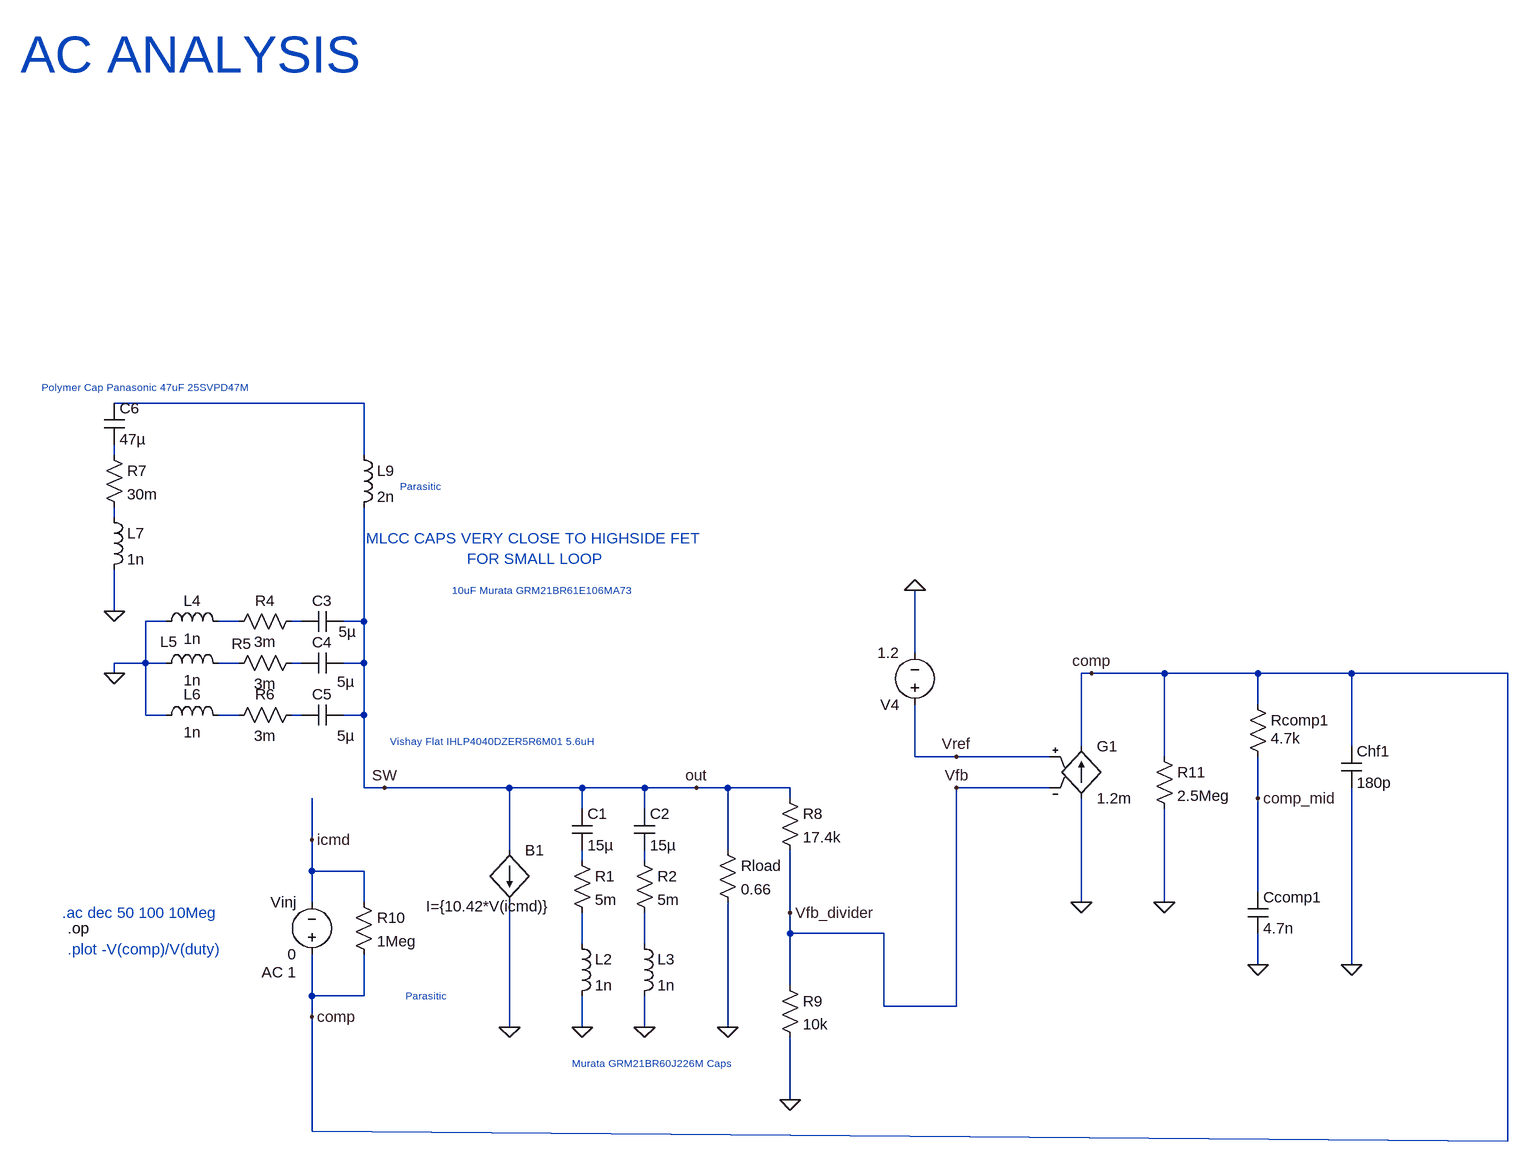
[diagram p0: schematic AC analysis.asc]
AC analysis.asc, the LTspice schematic file:
Version 4.1
SHEET 1 2836 904
WIRE 1072 -400 688 -400
WIRE 688 -320 688 -336
WIRE 1072 -320 1072 -400
WIRE 688 -224 688 -240
WIRE 688 -80 688 -144
WIRE 768 -64 736 -64
WIRE 880 -64 848 -64
WIRE 976 -64 960 -64
WIRE 1072 -64 1072 -240
WIRE 1072 -64 1040 -64
WIRE 1920 -16 1920 -112
WIRE 736 0 736 -64
WIRE 736 0 688 0
WIRE 768 0 736 0
WIRE 880 0 848 0
WIRE 976 0 960 0
WIRE 1072 0 1072 -64
WIRE 1072 0 1040 0
WIRE 688 16 688 0
WIRE 2192 16 2176 16
WIRE 2304 16 2192 16
WIRE 2448 16 2304 16
WIRE 2592 16 2448 16
WIRE 2832 16 2592 16
WIRE 2448 64 2448 16
WIRE 736 80 736 0
WIRE 768 80 736 80
WIRE 880 80 848 80
WIRE 976 80 960 80
WIRE 1072 80 1072 0
WIRE 1072 80 1040 80
WIRE 2176 128 2176 16
WIRE 2592 128 2592 16
WIRE 1920 144 1920 64
WIRE 1984 144 1920 144
WIRE 2128 144 1984 144
WIRE 2304 144 2304 16
WIRE 1072 192 1072 80
WIRE 1104 192 1072 192
WIRE 1296 192 1104 192
WIRE 1408 192 1296 192
WIRE 1504 192 1408 192
WIRE 1584 192 1504 192
WIRE 1632 192 1584 192
WIRE 1728 192 1632 192
WIRE 2128 192 1984 192
WIRE 1728 208 1728 192
WIRE 2448 208 2448 144
WIRE 1408 224 1408 192
WIRE 1504 224 1504 192
WIRE 992 272 992 208
WIRE 1296 288 1296 192
WIRE 1632 288 1632 192
WIRE 1408 304 1408 288
WIRE 1504 304 1504 288
WIRE 992 320 992 272
WIRE 1072 320 992 320
WIRE 2448 352 2448 208
WIRE 992 368 992 320
WIRE 1072 368 1072 320
WIRE 2176 368 2176 208
WIRE 2304 368 2304 224
WIRE 1728 384 1728 288
WIRE 1728 416 1728 384
WIRE 1872 416 1728 416
WIRE 1408 432 1408 384
WIRE 1504 432 1504 384
WIRE 2448 464 2448 416
WIRE 2592 464 2592 192
WIRE 1728 496 1728 416
WIRE 992 512 992 448
WIRE 1072 512 1072 448
WIRE 1072 512 992 512
WIRE 1872 528 1872 416
WIRE 1984 528 1984 192
WIRE 1984 528 1872 528
WIRE 992 544 992 512
WIRE 1296 560 1296 368
WIRE 1408 560 1408 512
WIRE 1504 560 1504 512
WIRE 1632 560 1632 368
WIRE 1728 672 1728 576
WIRE 992 720 992 544
WIRE 2832 736 2832 16
WIRE 2832 736 992 720
FLAG 1408 560 0
FLAG 1504 560 0
FLAG 688 16 0
FLAG 688 -80 0
FLAG 1104 192 SW
FLAG 1984 144 Vref
FLAG 1984 192 Vfb
FLAG 2192 16 comp
FLAG 2176 368 0
FLAG 1920 -112 0
FLAG 1728 672 0
FLAG 2448 464 0
FLAG 2592 464 0
FLAG 2448 208 comp_mid
FLAG 1584 192 out
FLAG 1728 384 Vfb_divider
FLAG 992 272 icmd
FLAG 992 544 comp
FLAG 2304 368 0
FLAG 1296 560 0
FLAG 1632 560 0
DATAFLAG 2064 192 ""
DATAFLAG 2064 144 ""
DATAFLAG 2384 16 ""
DATAFLAG 1776 416 ""
DATAFLAG 1664 192 ""
SYMBOL cap 1392 224 R0
SYMATTR InstName C1
SYMATTR Value 15µ
SYMBOL cap 1488 224 R0
SYMATTR InstName C2
SYMATTR Value 15µ
SYMBOL res 1392 288 R0
SYMATTR InstName R1
SYMATTR Value 5m
SYMBOL ind 1392 416 R0
SYMATTR InstName L2
SYMATTR Value 1n
SYMATTR SpiceLine Rser=0
SYMBOL ind 1488 416 R0
SYMATTR InstName L3
SYMATTR Value 1n
SYMATTR SpiceLine Rser=0
SYMBOL res 1488 288 R0
SYMATTR InstName R2
SYMATTR Value 5m
SYMBOL cap 1040 -80 R90
WINDOW 0 0 32 VBottom 2
WINDOW 3 16 -7 VTop 2
SYMATTR InstName C3
SYMATTR Value 5µ
SYMBOL cap 1040 -16 R90
WINDOW 0 0 32 VBottom 2
WINDOW 3 29 -4 VTop 2
SYMATTR InstName C4
SYMATTR Value 5µ
SYMBOL cap 1040 64 R90
WINDOW 0 0 32 VBottom 2
WINDOW 3 32 -4 VTop 2
SYMATTR InstName C5
SYMATTR Value 5µ
SYMBOL res 976 -80 R90
WINDOW 0 0 56 VBottom 2
WINDOW 3 32 56 VTop 2
SYMATTR InstName R4
SYMATTR Value 3m
SYMBOL ind 752 -48 R270
WINDOW 0 32 56 VTop 2
WINDOW 3 5 56 VBottom 2
SYMATTR InstName L4
SYMATTR Value 1n
SYMATTR SpiceLine Rser=0
SYMBOL ind 752 16 R270
WINDOW 0 33 20 VTop 2
WINDOW 3 5 56 VBottom 2
SYMATTR InstName L5
SYMATTR Value 1n
SYMATTR SpiceLine Rser=0
SYMBOL ind 752 96 R270
WINDOW 0 32 56 VTop 2
WINDOW 3 5 56 VBottom 2
SYMATTR InstName L6
SYMATTR Value 1n
SYMATTR SpiceLine Rser=0
SYMBOL res 976 -16 R90
WINDOW 0 2 92 VBottom 2
WINDOW 3 32 56 VTop 2
SYMATTR InstName R5
SYMATTR Value 3m
SYMBOL res 976 64 R90
WINDOW 0 0 56 VBottom 2
WINDOW 3 32 56 VTop 2
SYMATTR InstName R6
SYMATTR Value 3m
SYMBOL cap 672 -400 R0
SYMATTR InstName C6
SYMATTR Value 47µ
SYMBOL res 672 -336 R0
SYMATTR InstName R7
SYMATTR Value 30m
SYMBOL ind 672 -240 R0
SYMATTR InstName L7
SYMATTR Value 1n
SYMATTR SpiceLine Rser=0
SYMBOL ind 1056 -336 R0
SYMATTR InstName L9
SYMATTR Value 2n
SYMATTR SpiceLine Rser=1m
SYMBOL g 2176 112 R0
SYMATTR InstName G1
SYMATTR Value 1.2m
SYMBOL voltage 1920 80 R180
WINDOW 123 0 0 Left 0
WINDOW 39 0 0 Left 0
SYMATTR InstName V4
SYMATTR Value 1.2
SYMBOL res 1712 192 R0
SYMATTR InstName R8
SYMATTR Value 17.4k
SYMBOL res 1712 480 R0
SYMATTR InstName R9
SYMATTR Value 10k
SYMBOL res 2432 48 R0
WINDOW 3 36 68 Left 2
SYMATTR Value 4.7k
SYMATTR InstName Rcomp1
SYMBOL cap 2576 128 R0
SYMATTR InstName Chf1
SYMATTR Value 180p
SYMBOL cap 2432 352 R0
SYMATTR InstName Ccomp1
SYMATTR Value 4.7n
SYMBOL voltage 992 464 R180
WINDOW 0 24 96 Left 2
WINDOW 3 24 16 Left 2
WINDOW 123 24 -12 Left 2
WINDOW 39 0 0 Left 0
SYMATTR InstName Vinj
SYMATTR Value 0
SYMATTR Value2 AC 1
SYMBOL res 1056 352 R0
SYMATTR InstName R10
SYMATTR Value 1Meg
SYMBOL res 2288 128 R0
SYMATTR InstName R11
SYMATTR Value 2.5Meg
SYMBOL bi 1296 288 R0
WINDOW 3 -128 86 Left 2
SYMATTR InstName B1
SYMATTR Value I={10.42*V(icmd)}
SYMBOL res 1616 272 R0
SYMATTR InstName Rload
SYMATTR Value 0.66
TEXT 1392 616 Left 1 ;Murata GRM21BR60J226M Caps
TEXT 1112 120 Left 1 ;Vishay Flat IHLP4040DZER5R6M01 5.6uH
TEXT 1336 -176 Center 2 ;MLCC CAPS VERY CLOSE TO HIGHSIDE FET \nFOR SMALL LOOP
TEXT 1208 -112 Left 1 ;10uF Murata GRM21BR61E106MA73
TEXT 576 -424 Left 1 ;Polymer Cap Panasonic 47uF 25SVPD47M
TEXT 1128 -272 Left 1 ;Parasitic
TEXT 1136 512 Left 1 ;Parasitic
TEXT 544 -936 Left 6 ;AC ANALYSIS
TEXT 608 384 Left 2 ;.ac dec 50 100 10Meg
TEXT 616 408 Left 2 !.op
TEXT 616 440 Left 2 ;.plot -V(comp)/V(duty)

The netlist it stands for:
* AC analysis.asc
C1 out N010 15µ
C2 out N011 15µ
R1 N010 N012 5m
L2 N012 0 1n Rser=0
L3 N013 0 1n Rser=0
R2 N011 N013 5m
C3 out N005 5µ
C4 out N007 5µ
C5 out N009 5µ
R4 N005 N004 3m
L4 0 N004 1n Rser=0
L5 0 N006 1n Rser=0
L6 0 N008 1n Rser=0
R5 N007 N006 3m
R6 N009 N008 3m
C6 N001 N002 47µ
R7 N002 N003 30m
L7 N003 0 1n Rser=0
L9 N001 out 2n Rser=1m
G1 0 comp Vref Vfb_divider 1.2m
V4 Vref 0 1.2
R8 out Vfb_divider 17.4k
R9 Vfb_divider 0 10k
Rcomp1 comp comp_mid 4.7k
Chf1 comp 0 180p
Ccomp1 comp_mid 0 4.7n
Vinj comp icmd 0 AC 1
R10 icmd comp 1Meg
R11 comp 0 2.5Meg
B1 out 0 I={10.42*V(icmd)}
Rload out 0 0.66
* Murata GRM21BR60J226M Caps
* Vishay Flat IHLP4040DZER5R6M01 5.6uH
* MLCC CAPS VERY CLOSE TO HIGHSIDE FET
* FOR SMALL LOOP
* 10uF Murata GRM21BR61E106MA73
* Polymer Cap Panasonic 47uF 25SVPD47M
* Parasitic
* Parasitic
* AC ANALYSIS
* .ac dec 50 100 10Meg
.op
* .plot -V(comp)/V(duty)
.backanno
.end